# Altium schematic sheet STLink_Schematic.SchDoc
size A3; SheetNumber: 1; SheetTotal: 1
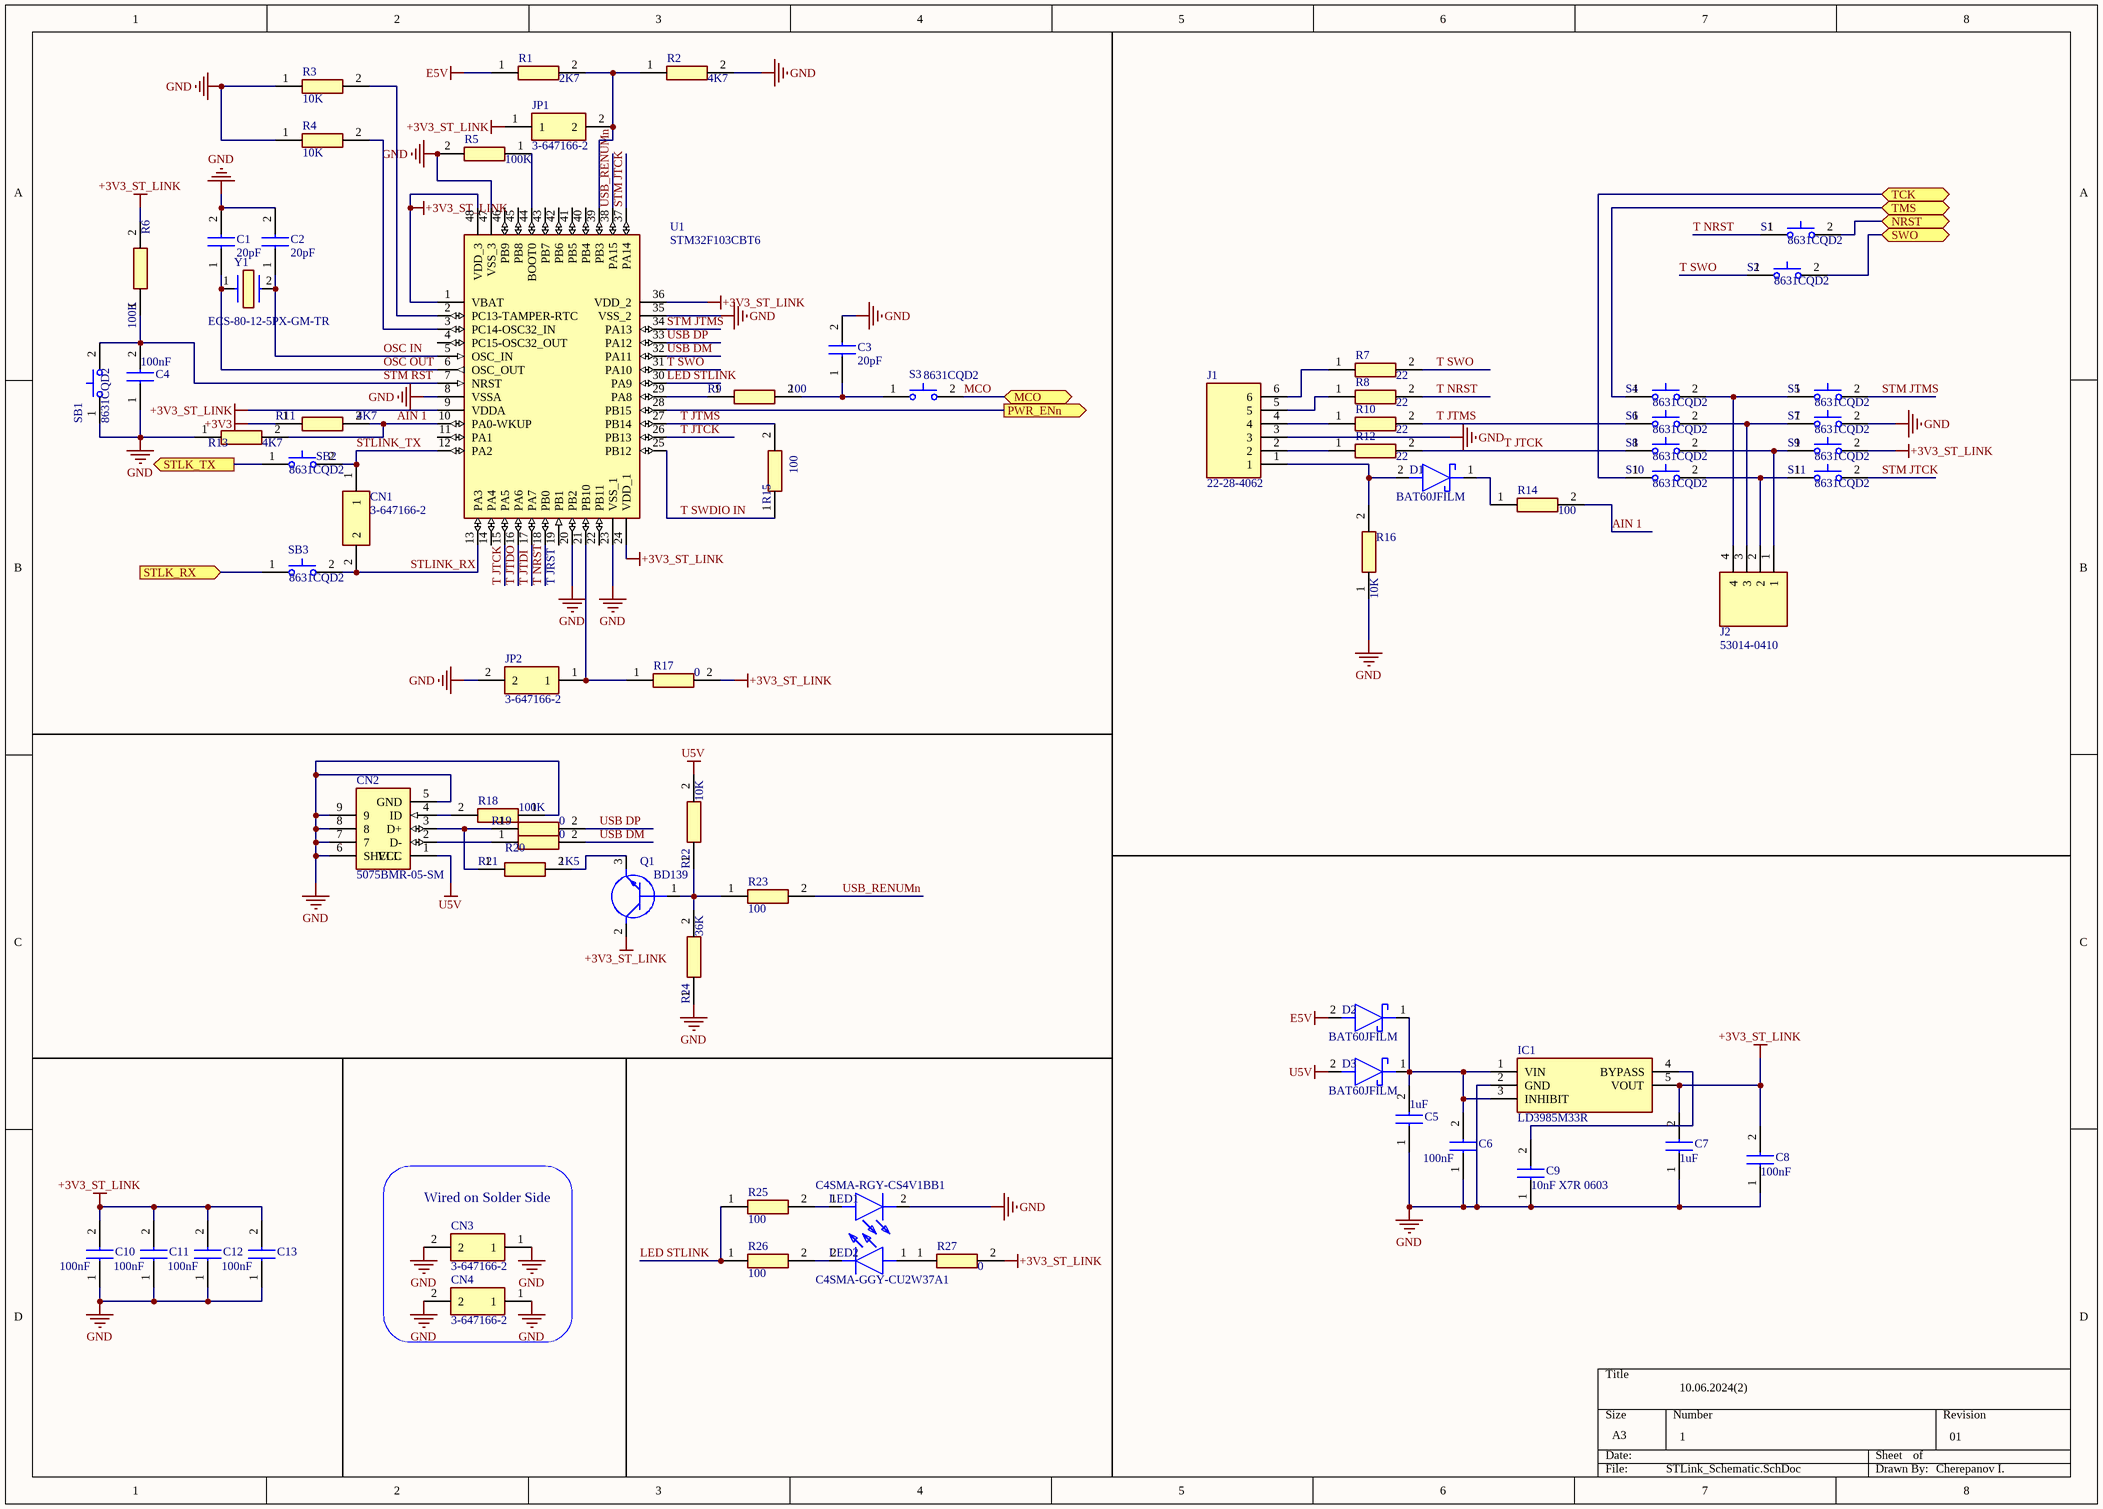
[diagram p0: STLink_Schematic.SchDoc]

## Parts
C1  20pF  [C1206]
C2  20pF  [C1206]
C3  20pF  [C1206]
C4  100nF  [CAPC1608X90N]
C5  1uF  [MAJx16]
C6  100nF  [CAPC1608X90N]
C7  1uF  [MAJx16]
C8  100nF  [CAPC1608X90N]
C9  10nF X7R 0603  [CAPC3316X145N]
C10  100nF  [CAPC1608X90N]
C11  100nF  [CAPC1608X90N]
C12  100nF  [CAPC1608X90N]
C13  100nF  [CAPC1608X90N]
CN1  3-647166-2  [36471662]
CN2  5075BMR-05-SM  [5075BMR05SM]
CN3  3-647166-2  [36471662]
CN4  3-647166-2  [36471662]
D1  BAT60JFILM  [SOD2513X117N]
D2  BAT60JFILM  [SOD2513X117N]
D3  BAT60JFILM  [SOD2513X117N]
IC1  LD3985M33R  [SOT95P280X145-5N]
J1  22-28-4062  [HDRV6W66P0X254_1X6_1524X249X838P]
J2  53014-0410  [SHDR4W60P0X200_1X4_1200X435X1000P]
JP1  3-647166-2  [36471662]
JP2  3-647166-2  [36471662]
LED1  C4SMA-RGY-CS4V1BB1  [C4SMARGYCS4V1BB1]
LED2  C4SMA-GGY-CU2W37A1  [C4SMAGGYCU2W37A1]
Q1  BD139  [TO254P290X760X1320-3P]
R1  2K7  [RESC3225X70N]
R2  4K7  [RESC1005X37N]
R3  10K  [RESC6331X80N]
R4  10K  [RESC6331X80N]
R5  100K  [RESC1005X40N]
R6  100K  [RESC1005X40N]
R7  22  [ERA6AEB1020V]
R8  22  [ERA6AEB1020V]
R9  100  [RESC1005X37N]
R10  22  [ERA6AEB1020V]
R11  4K7  [RESC1005X37N]
R12  22  [ERA6AEB1020V]
R13  4K7  [RESC1005X37N]
R14  100  [RESC1005X37N]
R15  100  [RESC1005X37N]
R16  10K  [RESC1005X40N]
R17  0  [RESC2013X84N]
R18  100K  [RESC1005X40N]
R19  0  [RESC2013X84N]
R20  0  [RESC2013X84N]
R21  1K5  [RESC3116X65N]
R22  10K  [RESC1005X40N]
R23  100  [RESC1005X37N]
R24  36K  [RESC2012X55N]
R25  100  [RESC1005X37N]
R26  100  [RESC1005X37N]
R27  0  [RESC2013X84N]
S1  8631CQD2  [8631CQD2]
S2  8631CQD2  [8631CQD2]
S3  8631CQD2  [8631CQD2]
S4  8631CQD2  [8631CQD2]
S5  8631CQD2  [8631CQD2]
S6  8631CQD2  [8631CQD2]
S7  8631CQD2  [8631CQD2]
S8  8631CQD2  [8631CQD2]
S9  8631CQD2  [8631CQD2]
S10  8631CQD2  [8631CQD2]
S11  8631CQD2  [8631CQD2]
SB1  8631CQD2  [8631CQD2]
SB2  8631CQD2  [8631CQD2]
SB3  8631CQD2  [8631CQD2]
U1  STM32F103CBT6  [QFP50P900X900X160-48N]
Y1  ECS-80-12-5PX-GM-TR  [ECS80125PXGMTR]

## Blocks framed on the sheet
Wired on Solder Side: CN3 CN4

## Ports
MCO (bidir), NRST (bidir), PWR_ENn (out), STLK_RX (in), STLK_TX (out), SWO (bidir), TCK (bidir), TMS (bidir)

## Nets
+3V3: R11.1
+3V3_ST_LINK: C7.2 C8.2 C10.2 C11.2 C12.2 C13.2 IC1.5(VOUT) JP1.1 Q1.2(C) R6.2 R17.2 R27.2 S9.2(N.O._2) U1.1(VBAT) U1.9(VDDA) U1.24(VDD_1) U1.36(VDD_2) U1.48(VDD_3)
E5V: D2.2(A) R1.1
GND: C1.2 C2.2 C3.2 C4.1 C5.1 C6.1 C7.1 C8.1 C9.1 C10.1 C11.1 C12.1 C13.1 CN2.5(GND) CN2.6(SHELL) CN2.7 CN2.8 CN2.9 CN3.1 CN3.2 CN4.1 CN4.2 IC1.2(GND) J1.3 JP2.2 LED1.2(K) R2.2 R3.1 R4.1 R5.2 R13.1 R16.1 R18.1 R24.1 S7.2(N.O._2) SB1.1(N.O._1) U1.8(VSSA) U1.20(PB2) U1.23(VSS_1) U1.35(VSS_2) U1.47(VSS_3)
U5V: CN2.1(VCC) D3.2(A) R22.2
AIN 1: R11.2 R13.2 R14.2 U1.10(PA0-WKUP)
LED STLINK: R25.1 R26.1 U1.30(PA9)
MCO: S3.2(N.O._2) ; port MCO
NRST: S1.2(N.O._2) ; port NRST
OSC IN: C2.1 U1.5(OSC_IN) Y1.2
OSC OUT: C1.1 U1.6(OSC_OUT) Y1.1
PWR_ENn: U1.28(PB15) ; port PWR_ENn
STLINK_RX: CN1.2 SB3.2(N.O._2) U1.13(PA3)
STLINK_TX: CN1.1 SB2.2(N.O._2) U1.12(PA2)
STLK_RX: SB3.1(N.O._1) ; port STLK_RX
STLK_TX: SB2.1(N.O._1) ; port STLK_TX
STM JTCK: S11.2(N.O._2) U1.37(PA14)
STM JTMS: S5.2(N.O._2) U1.34(PA13)
STM RST: C4.2 R6.1 SB1.2(N.O._2) U1.7(NRST)
SWO: S2.2(N.O._2) ; port SWO
T JTCK: R12.2 S8.1(N.O._1) U1.15(PA5) U1.26(PB13)
T JTDI: U1.17(PA7)
T JTDO: U1.16(PA6)
T JTMS: R10.2 R15.2 S6.1(N.O._1) U1.27(PB14)
T NRST: R8.2 S1.1(N.O._1) U1.18(PB0)
T SWDIO IN: R15.1 U1.25(PB12)
T SWO: R7.2 S2.1(N.O._1) U1.31(PA10)
TCK: S10.1(N.O._1) ; port TCK
TMS: S4.1(N.O._1) ; port TMS
USB DM: R20.2 U1.32(PA11)
USB DP: R19.2 U1.33(PA12)
USB_RENUMn: R23.2 U1.38(PA15)
NetC3_1: C3.1 R9.2 S3.1(N.O._1)
NetC5_2: C5.2 C6.2 D2.1(K) D3.1(K) IC1.1(VIN) IC1.3(INHIBIT)
NetC9_2: C9.2 IC1.4(BYPASS)
NetCN2_2: CN2.2(D-) R20.1
NetCN2_3: CN2.3(D+) R19.1 R21.1
NetCN2_4: CN2.4(ID) R18.2
NetD1_1: D1.1(K) R14.1
NetD1_2: D1.2(A) J1.1 R16.2
NetJ1_2: J1.2 R12.1
NetJ1_4: J1.4 R10.1
NetJ1_5: J1.5 R8.1
NetJ1_6: J1.6 R7.1
NetJ2_1: J2.1 S8.2(N.O._2) S9.1(N.O._1)
NetJ2_2: J2.2 S10.2(N.O._2) S11.1(N.O._1)
NetJ2_3: J2.3 S6.2(N.O._2) S7.1(N.O._1)
NetJ2_4: J2.4 S4.2(N.O._2) S5.1(N.O._1)
NetJP1_2: JP1.2 R1.2 R2.1 U1.39(PB3)
NetJP2_1: JP2.1 R17.1 U1.21(PB10)
NetLED1_1: LED1.1(A) R25.2
NetLED2_1: LED2.1(A) R27.1
NetLED2_2: LED2.2(K) R26.2
NetQ1_1: Q1.1(B) R22.1 R23.1 R24.2
NetQ1_3: Q1.3(E) R21.2
NetR3_2: R3.2 U1.2(PC13-TAMPER-RTC)
NetR4_2: R4.2 U1.3(PC14-OSC32_IN)
NetR5_1: R5.1 U1.44(BOOT0)
NetR9_1: R9.1 U1.29(PA8)

Not connected (* = marked no-connect by the designer): U1 4(PC15-OSC32_OUT) 11(PA1) 14(PA4) 19(PB1) 22(PB11) 40(PB4) 41(PB5) 42(PB6) 43(PB7) 45(PB8) 46(PB9)

## Notes on the sheet
- (near U1) T JRST
- 10.06.2024(2)
- 1
- 01
- Cherepanov I.

## Library data of the parts
C1-C3 = C1206C200KCGACTU: Capacitor; Manufacturer_Name: KEMET; Datasheet Link: https://content.kemet.com/datasheets/KEM_C1009_C0G_HV_SMD.pdf; Manufacturer_Part_Number: C1206C200KCGACTU
C4 C6 C8 C10-C13 = KAM15AR71H104KM: Capacitor; Manufacturer_Name: Kyocera AVX; Datasheet Link: https://datasheets.kyocera-avx.com/AutoMLCCKAM.pdf; Height: 0.9mm; Manufacturer_Part_Number: KAM15AR71H104KM; Mouser Part Number: 581-KAM15AR71H104KM; Mouser Price/Stock: https://www.mouser.co.uk/ProductDetail/KYOCERA-AVX/KAM15AR71H104KM?qs=Jm2GQyTW%2FbgzS5FHJWrFzQ%3D%3D; Arrow Part Number: KAM15AR71H104KM; Arrow Price/Stock: https://www.arrow.com/en/products/kam15ar71h104km/avx?region=nac
C5 C7 = MAJCT168BB7105KTEA01: Capacitor; Manufacturer_Name: TAIYO YUDEN; Datasheet Link: https://ds.yuden.co.jp/TYCOMPAS/or/detail?pn=MAJCT168BB7105KTEA01; Height: 0.8mm; Manufacturer_Part_Number: MAJCT168BB7105KTEA01
C9 = KGM31GCG2J103JU: Capacitor; Manufacturer_Name: Kyocera AVX; Datasheet Link: https://datasheets.kyocera-avx.com/HVKGM.pdf; Height: 1.45mm; Manufacturer_Part_Number: KGM31GCG2J103JU; Mouser Part Number: 581-KGM31GCG2J103JU; Mouser Price/Stock: https://www.mouser.co.uk/ProductDetail/KYOCERA-AVX/KGM31GCG2J103JU?qs=63Lh8XYXgjt6ivbLeGkCxg%3D%3D
CN1 CN3 CN4 JP1 JP2 = 3-647166-2: Connector; Manufacturer_Name: TE Connectivity; Datasheet Link: https://www.te.com/commerce/DocumentDelivery/DDEController?Action=showdoc&DocId=Customer+Drawing%7F647166%7FR1%7Fpdf%7FEnglish%7FENG_CD_647166_R1.pdf%7F3-647166-2; Height: 10.66mm; Manufacturer_Part_Number: 3-647166-2; Mouser Part Number: 571-3-647166-2; Mouser Price/Stock: https://www.mouser.co.uk/ProductDetail/TE-Connectivity/3-647166-2?qs=xsTFCgGnzbJU1qz6Np9kzA%3D%3D; Arrow Part Number: 3-647166-2; Arrow Price/Stock: https://www.arrow.com/en/products/3-647166-2/te-connectivity?region=nac
CN2 = 5075BMR-05-SM: Connector; Manufacturer_Name: NELTRON; Datasheet Link: http://www.ibselectronics.com/ibsstore/datasheet/5075BMR-05-SM-CR.pdf; Height: 4mm; Manufacturer_Part_Number: 5075BMR-05-SM
D1-D3 = BAT60JFILM: Schottky Diode; Manufacturer_Name: STMicroelectronics; Datasheet Link: https://www.mouser.jp/datasheet/2/389/cd00001944-1795661.pdf; Height: 1.17mm; Manufacturer_Part_Number: BAT60JFILM; Mouser Part Number: 511-BAT60JFILM; Mouser Price/Stock: https://www.mouser.co.uk/ProductDetail/STMicroelectronics/BAT60JFILM?qs=GnFZssByvVVVnMaukcyLZg%3D%3D; Arrow Part Number: BAT60JFILM; Arrow Price/Stock: https://www.arrow.com/en/products/bat60jfilm/stmicroelectronics?region=nac
IC1 = LD3985M33R: Integrated Circuit; Manufacturer_Name: STMicroelectronics; Datasheet Link: http://www.st.com/st-web-ui/static/active/en/resource/technical/document/datasheet/CD00003395.pdf; Height: 1.45mm; Manufacturer_Part_Number: LD3985M33R; Mouser Part Number: 511-LD3985M33R; Mouser Price/Stock: https://www.mouser.co.uk/ProductDetail/STMicroelectronics/LD3985M33R?qs=22WmWNTp1rrPOccVv4HZ7A%3D%3D; Arrow Part Number: LD3985M33R; Arrow Price/Stock: https://www.arrow.com/en/products/ld3985m33r/stmicroelectronics?region=europe
J1 = 22-28-4062: Connector; Manufacturer_Name: Molex; Datasheet Link: https://datasheet.datasheetarchive.com/originals/distributors/SFDatasheet-1/sf-00031037.pdf; Height: 8.38mm; Manufacturer_Part_Number: 22-28-4062; Mouser Part Number: 538-22-28-4062; Mouser Price/Stock: https://www.mouser.com/Search/Refine.aspx?Keyword=538-22-28-4062
J2 = 53014-0410: Connector; Manufacturer_Name: Molex; Datasheet Link: https://www.molex.com/pdm_docs/sd/530140410_sd.pdf; Height: 10mm; Manufacturer_Part_Number: 53014-0410; Mouser Part Number: 538-53014-0410; Mouser Price/Stock: https://www.mouser.co.uk/ProductDetail/Molex/53014-0410?qs=TLs3Kb%252BkMqKk8s1WRHwRGw%3D%3D
LED1 = C4SMA-RGY-CS4V1BB1: LED; Manufacturer_Name: CREE LED; Datasheet Link: https://cree-led.com/media/documents/C4SMA-1442.pdf; Height: 8.8mm; Manufacturer_Part_Number: C4SMA-RGY-CS4V1BB1; Mouser Part Number: 941-C4SMARGYCS4V1BB1; Mouser Price/Stock: https://www.mouser.co.uk/ProductDetail/Cree-LED/C4SMA-RGY-CS4V1BB1?qs=7D1LtPJG0i08%2Fw1qRIcnyw%3D%3D; Arrow Part Number: C4SMA-RGY-CS4V1BB1; Arrow Price/Stock: https://www.arrow.com/en/products/c4sma-rgy-cs4v1bb1/cree-led?region=nac
LED2 = C4SMA-GGY-CU2W37A1: LED; Manufacturer_Name: CREE LED; Datasheet Link: https://cree-led.com/media/documents/C4SMA-1442.pdf; Height: 8.8mm; Manufacturer_Part_Number: C4SMA-GGY-CU2W37A1; Mouser Part Number: 941-C4SMAGGYCU2W37A1; Mouser Price/Stock: https://www.mouser.co.uk/ProductDetail/Cree-LED/C4SMA-GGY-CU2W37A1?qs=7D1LtPJG0i1gnYL5Rh9Mjg%3D%3D
Q1 = BD139: Transistor BJT NPN; Manufacturer_Name: STMicroelectronics; Datasheet Link: http://www.st.com/web/en/resource/technical/document/datasheet/CD00001225.pdf; Height: 2.9mm; Manufacturer_Part_Number: BD139; Mouser Part Number: 511-BD139; Mouser Price/Stock: https://www.mouser.co.uk/ProductDetail/STMicroelectronics/BD139?qs=ljbEvF4DwOPW%2FLxHSWYMMA%3D%3D; Arrow Part Number: BD139; Arrow Price/Stock: https://www.arrow.com/en/products/bd139/stmicroelectronics?region=europe
R1 = CRCW12102K70FKEAHP: Resistor; Manufacturer_Name: Vishay; Datasheet Link: http://componentsearchengine.com/Datasheets/1/CRCW12102K70FKEAHP.pdf; Height: 0.7mm; Manufacturer_Part_Number: CRCW12102K70FKEAHP; Mouser Part Number: 71-CRCW12102K70FKEAH; Mouser Price/Stock: https://www.mouser.co.uk/ProductDetail/Vishay-Dale/CRCW12102K70FKEAHP?qs=OAzHGkhREL0m0%252BU1n6AaAg%3D%3D
R2 R11 R13 = MCS04020D4701BE000: Resistor; Manufacturer_Name: Vishay; Datasheet Link: http://www.vishay.com/docs/28705/mcx0x0xpro.pdf; Height: 0.37mm; Manufacturer_Part_Number: MCS04020D4701BE000; Mouser Part Number: 594-MCS04020D4701BE0; Mouser Price/Stock: https://www.mouser.co.uk/ProductDetail/Vishay-Beyschlag/MCS04020D4701BE000?qs=ft9OtscSA3%252BR0DpF5QqL2Q%3D%3D
R3 R4 = CRM2512QJW-103ELF: Resistor; Manufacturer_Name: Bourns; Datasheet Link: http://www.bourns.com/data/global/pdfs/CRM0805_1206_2010.pdf; Height: 0.8mm; Manufacturer_Part_Number: CRM2512QJW-103ELF; Mouser Part Number: 652-CRM2512QJW-103E; Mouser Price/Stock: https://www.mouser.co.uk/ProductDetail/Bourns/CRM2512QJW-103ELF?qs=8Wlm6%252BaMh8Rzg3bRHdWGsA%3D%3D; Arrow Part Number: CRM2512QJW-103ELF; Arrow Price/Stock: https://www.arrow.com/en/products/crm2512qjw-103elf/bourns?region=nac
R5 R6 R16 R18 R22 = SFR01MZPF1003: Resistor; Manufacturer_Name: ROHM Semiconductor; Datasheet Link: https://fscdn.rohm.com/en/products/databook/datasheet/passive/resistor/chip_resistor/sfr-e.pdf; Height: 0.4mm; Manufacturer_Part_Number: SFR01MZPF1003; Mouser Part Number: 755-SFR01MZPF1003; Mouser Price/Stock: https://www.mouser.co.uk/ProductDetail/ROHM-Semiconductor/SFR01MZPF1003?qs=Mv7BduZupUj2RFL5gMaKTg%3D%3D
R7 R8 R10 R12 = ERA-6AHD220V: Resistor; Manufacturer_Name: Panasonic; Datasheet Link: https://industrial.panasonic.com/cdbs/www-data/pdf/RDM0000/AOA0000C307.pdf; Height: 0.6mm; Manufacturer_Part_Number: ERA-6AHD220V; Mouser Part Number: 667-ERA-6AHD220V; Mouser Price/Stock: https://www.mouser.co.uk/ProductDetail/Panasonic/ERA-6AHD220V/?qs=MNPzkKEzRtQTWqg2JSKn2A%3D%3D
R9 R14 R15 R23 R25 R26 = MCS04020C1000FE000: Resistor; Manufacturer_Name: Vishay; Datasheet Link: http://www.vishay.com/docs/28705/mcx0x0xpro.pdf; Height: 0.37mm; Manufacturer_Part_Number: MCS04020C1000FE000; Mouser Part Number: 594-MCS04020C1000FE0; Mouser Price/Stock: https://www.mouser.co.uk/ProductDetail/Vishay-Beyschlag/MCS04020C1000FE000?qs=7ZE6F4QMOBYkwvQlfbkT8w%3D%3D; Arrow Part Number: MCS04020C1000FE000; Arrow Price/Stock: https://www.arrow.com/en/products/mcs04020c1000fe000/vishay
R17 R19 R20 R27 = WSL080500000ZEA9: Resistor; Manufacturer_Name: Vishay; Datasheet Link: https://ad.componentsearchengine.com/Datasheets/2/WSL080500000ZEA9.pdf; Height: 0.838mm; Manufacturer_Part_Number: WSL080500000ZEA9; Mouser Part Number: 71-WSL080500000ZEA9; Mouser Price/Stock: https://www.mouser.co.uk/ProductDetail/Vishay-Dale/WSL080500000ZEA9?qs=f1l5vAGoKgsImKS87N8TmQ%3D%3D; Arrow Part Number: WSL080500000ZEA9; Arrow Price/Stock: https://www.arrow.com/en/products/wsl080500000zea9/vishay?region=nac
R21 = CRCW12061K50FKEAHP: Resistor; Manufacturer_Name: Vishay; Datasheet Link: http://componentsearchengine.com/Datasheets/1/CRCW12061K50FKEAHP.pdf; Height: 0.65mm; Manufacturer_Part_Number: CRCW12061K50FKEAHP; Mouser Part Number: 71-CRCW12061K50FKEAH; Mouser Price/Stock: https://www.mouser.co.uk/ProductDetail/Vishay-Dale/CRCW12061K50FKEAHP?qs=k2%2FDWSARqgEwHXAQbL4aEg%3D%3D; Arrow Part Number: CRCW12061K50FKEAHP; Arrow Price/Stock: https://www.arrow.com/en/products/crcw12061k50fkeahp/vishay?region=nac
R24 = TNPW080536K0BEEA: Resistor; Manufacturer_Name: Vishay; Datasheet Link: https://www.vishay.com/docs/31006/tnpw.pdf; Height: 0.55mm; Manufacturer_Part_Number: TNPW080536K0BEEA
S1-S11 SB1-SB3 = 8631CQD2: Switch (2-Pin Push); Manufacturer_Name: C & K COMPONENTS; Datasheet Link: https://www.ckswitches.com/media/1396/8600.pdf; Height: 13.93mm; Manufacturer_Part_Number: 8631CQD2; Mouser Part Number: 611-8631-261; Mouser Price/Stock: https://www.mouser.co.uk/ProductDetail/CK/8631CQD2?qs=ktcBc77oICXe9iPhfEwnkA%3D%3D
U1 = STM32F103CBT6: Integrated Circuit; Manufacturer_Name: STMicroelectronics; Datasheet Link: http://www.st.com/st-web-ui/static/active/en/resource/technical/document/datasheet/CD00161566.pdf; Height: 1.6mm; Manufacturer_Part_Number: STM32F103CBT6; Mouser Part Number: 511-STM32F103CBT6; Mouser Price/Stock: https://www.mouser.co.uk/ProductDetail/STMicroelectronics/STM32F103CBT6?qs=WxFF5lh7QM3goh6GV5Ogig%3D%3D; Arrow Part Number: STM32F103CBT6; Arrow Price/Stock: https://www.arrow.com/en/products/stm32f103cbt6/stmicroelectronics?region=europe
Y1 = ECS-80-12-5PX-GM-TR: Crystal or Oscillator; Manufacturer_Name: ECS; Datasheet Link: https://ecsxtal.com/store/pdf/csm-7x.pdf; Height: 4.3mm; Manufacturer_Part_Number: ECS-80-12-5PX-GM-TR; Mouser Part Number: 520-80-12-5PX-GM-TR; Mouser Price/Stock: https://www.mouser.co.uk/ProductDetail/ECS/ECS-80-12-5PX-GM-TR?qs=amGC7iS6iy%252BwzUdIY7WpOA%3D%3D